# Altium project SFCMasterL.PrjPCB
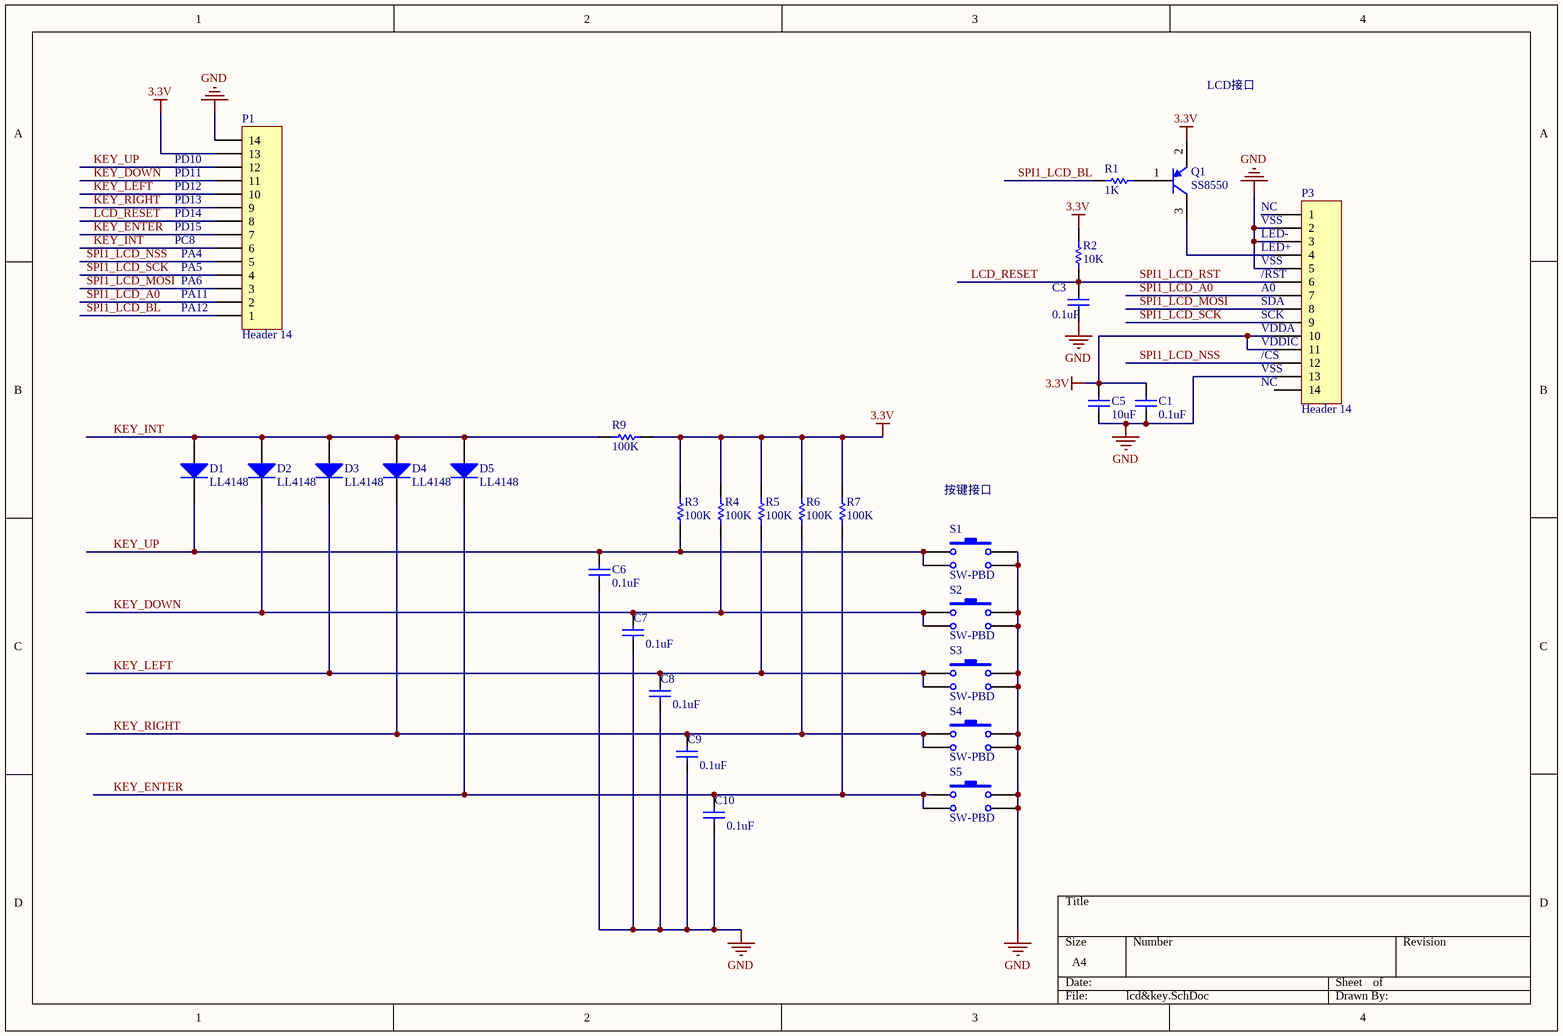
[diagram p0: lcd&key.SchDoc]
1 sheet, 29 parts. Net scope: global (net labels, ports and power ports of the same name join across sheets).
Board file: SFCmasterL.PcbDoc

## Sheet lcd&key.SchDoc
size A4

### Parts
C1  0.1uF  [CAPC2012M]
C3  0.1uF  [CAPC2012M]
C5  10uF  [CAPC2012M]
C6  0.1uF  [CAPC2012M]
C7  0.1uF  [CAPC2012M]
C8  0.1uF  [CAPC2012M]
C9  0.1uF  [CAPC2012M]
C10  0.1uF  [CAPC2012M]
D1  LL4148  [CD2012-0805]
D2  LL4148  [CD2012-0805]
D3  LL4148  [CD2012-0805]
D4  LL4148  [CD2012-0805]
D5  LL4148  [CD2012-0805]
P1  Header 14  [FPC0.5-14P-A]
P3  Header 14  [FPC14]
Q1  SS8550  [SOT-23_N]
R1  1K  [RESC2012M]
R2  10K  [RESC2012M]
R3  100K  [RESC2012M]
R4  100K  [RESC2012M]
R5  100K  [RESC2012M]
R6  100K  [RESC2012M]
R7  100K  [RESC2012M]
R9  100K  [RESC2012M]
S1  SW-PBD  [PBDIP-4.5x4.5]
S2  SW-PBD  [PBDIP-4.5x4.5]
S3  SW-PBD  [PBDIP-4.5x4.5]
S4  SW-PBD  [PBDIP-4.5x4.5]
S5  SW-PBD  [PBDIP-4.5x4.5]

### Nets
3.3V: C1.2 C5.2 P1.13 P3.10 P3.11 Q1.2(E) R2.1 R3.2 R4.2 R5.2 R6.2 R7.2 R9.2
GND: C1.1 C3.2 C5.1 C6.2 C7.2 C8.2 C9.2 C10.2 P1.14 P3.2 P3.3 P3.5 P3.13 S1.3 S1.4 S2.3 S2.4 S3.3 S3.4 S4.3 S4.4 S5.3 S5.4
KEY_DOWN: C7.1 D2.2(K) P1.11 R4.1 S2.1 S2.2
KEY_ENTER: C10.1 D5.2(K) P1.7 R7.1 S5.1 S5.2
KEY_INT: D1.1(A) D2.1(A) D3.1(A) D4.1(A) D5.1(A) P1.6 R9.1
KEY_LEFT: C8.1 D3.2(K) P1.10 R5.1 S3.1 S3.2
KEY_RIGHT: C9.1 D4.2(K) P1.9 R6.1 S4.1 S4.2
KEY_UP: C6.1 D1.2(K) P1.12 R3.1 S1.1 S1.2
LCD_RESET: C3.1 P1.8 P3.6 R2.2  [also labelled SPI1_LCD_RST]
SPI1_LCD_A0: P1.2 P3.7
SPI1_LCD_BL: P1.1 R1.2
SPI1_LCD_MOSI: P1.3 P3.8
SPI1_LCD_NSS: P1.5 P3.12
SPI1_LCD_SCK: P1.4 P3.9
NetP3_4: P3.4 Q1.3(C)
NetQ1_1: Q1.1(B) R1.1

Not connected (* = marked no-connect by the designer): P3 1 14

### Notes on the sheet
- LCD接口
- (near P1) PD11
- (near P1) PD10
- (near P1) PD12
- (near P1) PD13
- (near P1) PD14
- (near P1) PD15
- (near P1) PC8
- (near P3) NC
- (near P3) VSS
- (near P3) LED+
- (near P3) LED-
- (near P1) PA4
- (near P1) PA5
- (near P1) PA6
- (near P1) PA11
- (near P1) PA12
- (near P3) /RST
- (near P3) A0
- (near P3) SDA
- (near P3) VDDIC
- (near P3) SCK
- (near P3) VDDA
- (near P3) /CS
- 按键接口

### Library data of the parts
C1 C3 C5-C10 = Cap: Capacitor; Value: 1nF; Published: 8-Jun-2000; LatestRevisionDate: 17-Jul-2002; LatestRevisionNote: Re-released for DXP Platform.; PackageReference: RAD-0.3; Publisher: Altium Limited
D1-D5 = Diode 1N4007: 1 Amp General Purpose Rectifier; Published: 8-Jun-2000; LatestRevisionDate: 17-Jul-2002; LatestRevisionNote: Re-released for DXP Platform.; DatasheetVersion: 1998; PackageVersion: Aug-1999; PackageReference: DO-41; Publisher: Altium Limited; Code_JEDEC: DO-204-AL; ComponentLink1Description: Manufacturer Link; ComponentLink1URL: http://www.fairchildsemi.com/; ComponentLink2Description: Datasheet; ComponentLink2URL: http://www.fairchildsemi.com/ds/1N%2F1N4001.pdf
P1 P3 = Header 14: Header, 14-Pin; LatestRevisionDate: 17-Jul-2002; LatestRevisionNote: Re-released for DXP Platform.; Publisher: Altium Limited
Q1 = 2N3906: PNP General Purpose Amplifier; Published: 8-Jun-2000; LatestRevisionDate: 15-Jan-2003; LatestRevisionNote: PCB Footprint 'BCY-W3/D4.7' replaced; DatasheetVersion: 1997; PackageVersion: Sep-1998; PackageReference: TO-92A; Publisher: Altium Limited; Code_JEDEC: TO-92A; ComponentLink1Description: Manufacturer Link; ComponentLink1URL: http://www.fairchildsemi.com/; ComponentLink2Description: Datasheet; ComponentLink2URL: http://www.fairchildsemi.com/ds/2N%2F2N3906.pdf
R1 R3-R7 R9 = Res1: Resistor; Value: 10K; Published: 8-Jun-2000; LatestRevisionDate: 17-Jul-2002; LatestRevisionNote: Re-released for DXP Platform.; PackageReference: AXIAL-0.3; Publisher: Altium Limited
R2 = Res1: Resistor; Published: 8-Jun-2000; LatestRevisionDate: 17-Jul-2002; LatestRevisionNote: Re-released for DXP Platform.; PackageReference: AXIAL-0.3; Publisher: Altium Limited; Value: 10K
S1-S5 = SW-PBD: Switch; Published: 24-Mar-1999; LatestRevisionDate: 17-Jul-2002; LatestRevisionNote: Re-released for DXP Platform.; PackageReference: SPST-2; Publisher: Altium Limited; PackageDescription: Switch; 2 Leads